# EAGLE design TPS62827 3.3V Buck Converter (EAGLE 9.6.2)
COMPANY: ADAFRUIT INDUSTRIES; DRAWN: KTOWN; REV: A
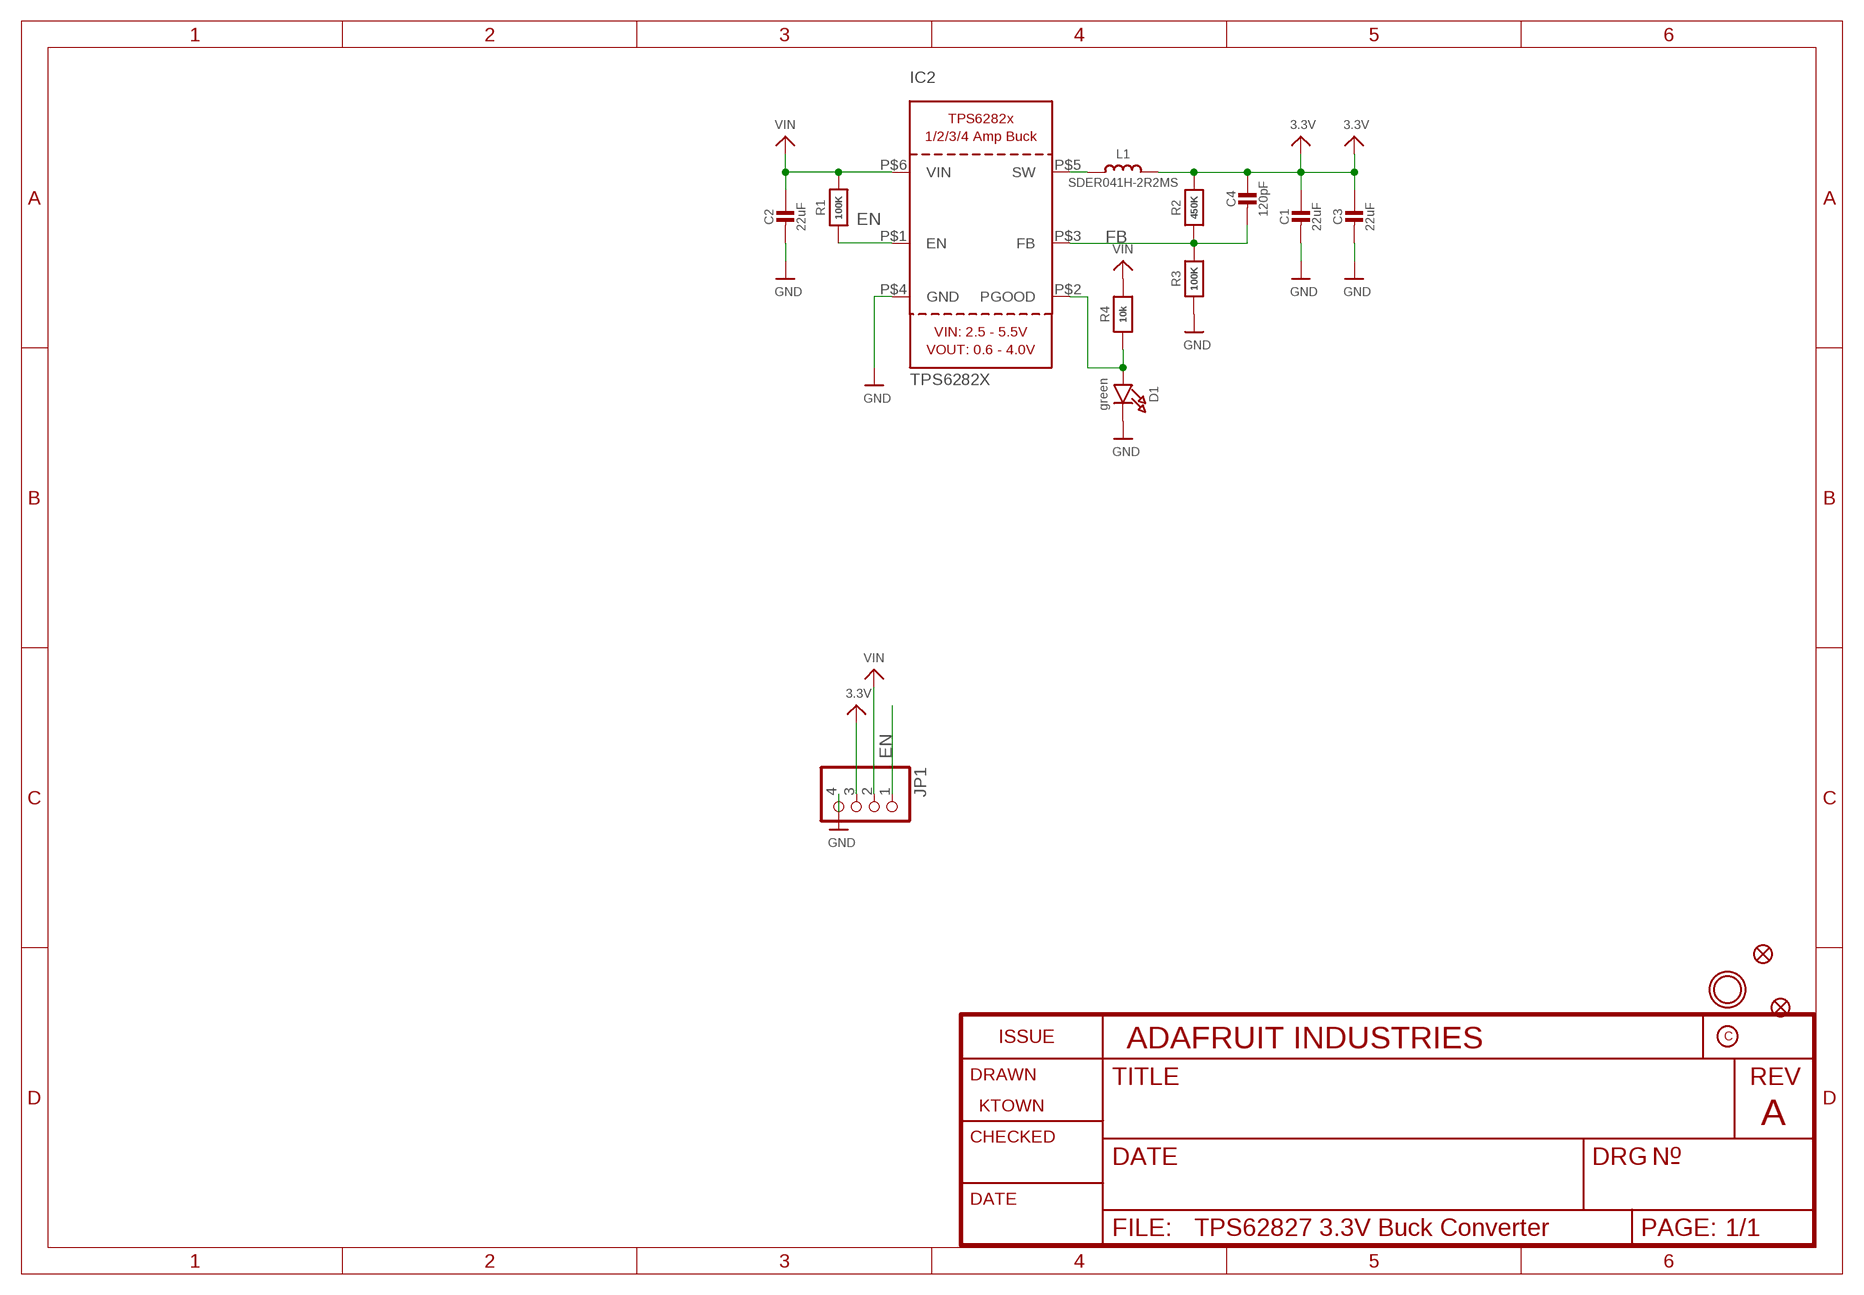
[diagram p0: schematic, sheet 1]

## Parts
C1  22uF  CAP_CERAMIC0805-NOOUTLINE  [0805-NO]
C2  22uF  CAP_CERAMIC0805-NOOUTLINE  [0805-NO]
C3  22uF  CAP_CERAMIC0805-NOOUTLINE  [0805-NO]
C4  120pF  CAP_CERAMIC0603_NO  [0603-NO]
D1  green  LED0603_NOOUTLINE  [CHIPLED_0603_NOOUTLINE]
FID1  FIDUCIAL_1MM  [FIDUCIAL_1MM]
FID2  FIDUCIAL_1MM  [FIDUCIAL_1MM]
IC2  TPS6282X  [VSON_6]
JP1  HEADER-1X4ROUND  [1X04_ROUND]
L1  SDER041H-2R2MS  INDUCTOR_SRP0415  [INDUCTOR_4X4MM_SRP0415]
R1  100K  RESISTOR_0603_NOOUT  [0603-NO]
R2  450K  RESISTOR_0603_NOOUT  [0603-NO]
R3  100K  RESISTOR_0603_NOOUT  [0603-NO]
R4  10k  RESISTOR_0603MP  [_0603MP]
U$9  MOUNTINGHOLE2.5  [MOUNTINGHOLE_2.5_PLATED]

## Nets
3.3V: C1.1 C3.1 C4.1 JP1.3 L1.P$2 R2.2
EN: IC2.P$1(EN) JP1.1 R1.2
FB: C4.2 IC2.P$3(FB) R2.1 R3.2
GND: C1.2 C2.2 C3.2 D1.C IC2.P$4(GND) JP1.4 R3.1
N$1: IC2.P$5(SW) L1.P$1
N$2: D1.A IC2.P$2(PGOOD) R4.1
VIN: C2.1 IC2.P$6(VIN) JP1.2 R1.1 R4.2

## Library data of the parts
C1-C4 = microbuilder:CAP_CERAMIC: Ceramic Capacitors For new designs, use the packages preceded by an '_' character since they are more reliable: The following footprints should be used on most boards: _0402 - Standard footprint for regular board layouts _0603 - Standard footprint for regular board layouts _0805 - Standard footprint for regular board layouts _1206 - Standard footprint for regular board layouts For extremely tight-pitch boards where space is at a premium, the following 'micro-pitch' footprints can be used (smaller pads, no silkscreen outline, etc.): _0402MP - Micro-pitch footprint for very dense/compact boards _0603MP - Micro-pitch footprint for very dense/compact boards _0805MP - Micro-pitch footprint for very dense/compact boards _1206MP - Micro-pitch footprint for very dense/compact boards
D1 = microbuilder:LED: LED 0603 - 0603 Surface Mount Package 2mA: Green LED - Low Power (3.9mcd, 2ma, 1.7Vf) - Digikey: 475-2709-2-ND Orange LED - Low Power (9.8mcd, 2ma, 1.8Vf) - Digikey: 475-1194-2-ND Red LED - Low Power (5mcd, 2ma, 1.8Vf) - Digikey: 475-1195-2-ND Yellow LED - Low Power (7mcd, 2ma, 1.8Vf) - Digikey: 475-1196-2-ND 5mA: Blue LED - Low Power (17mcd, 5ma, 2.9Vf) - Digikey: LNJ937W8CRACT-ND 0805 - 0805 Surface Mount Package 2mA: Red LED (8.8mcd, 2mA, 1.8Vf, Clear) - Low Power [Digikey: 475-2510-1-ND] Green LED (5mcd, 2mA, 1.8Vf, Clear) - Low Power [Digikey: 475-2730-1-ND] Yellow LED (11.3mcd, 2mA, 1.8Vf, Clear) - Low Power [Digikey: 475-2555-1-ND] 20mA: Red LED (104mcd, 20mA, Diffused) - LS R976 [Digikey: 475-1278-6-ND] Red LED (12mcd, 20mA, 2.0Vf, Clear) - APT2012EC [Digikey: 754-1128-1-ND] Green LED (15mcd, 20mA, 2.2Vf, Clear) - APT2012GC [Digikey: 754-1131-1-ND] Orange LED (160mcd, 20mA, 2.1Vf, Clear) - APT2012SECK [Digikey: 754-1130-1-ND] 1206 - 1206 Surface Mount Package Green LED (26mcd, 20mA, Diffused) - LG N971 [Digikey: 475-1407-6-ND] Red LED (15mcd, 20mA, Diffused) - LH N974 [Digikey: 475-1416-6-ND] Cree - Cree High-Power Surface Mount LEDs XPEBWT-L1-0000-00D50 - White 111lm 350mA 2.9Vf 6200K 110° XTEAWT-00-0000-00000LEE3 - White 114lm 350mA 2.85Vf 5000K 115° Everlight - Everlight 45-21 Series Surface Mount LEDs 45-21/QK2C-B2832AC2CB2/2T - Warm White 2000mcd 20mA 3.25Vf 3050K 120° 45-21/LK2C-B38452C4CB2/2T - Nuetral White 2000mcd 20mA 3.25Vf 4150K 120° 45-21/LK2C-B50634C6CB2/2T - Cold White 2200mcd 20mA 3.25Vf 5650K 120° PLCC2 Reverse Mount LS T77K-J1L2-1-0-2-R18-Z - Red 11.25mcd 2mA 1.8Vf 630nm 120° LO T77K-L1M2-24-Z - Orange 19.6mcd 2mA 1.8Vf 606nm 120° LY T77K-K2M1-26-Z - Yellow 15.7mcd 2mA 1.8Vf 587nm 120°
FID1 FID2 = microbuilder:FIDUCIAL: Fiducial Alignment Points Various fiducial points for machine vision alignment.; BOM: EXCLUDE
IC2 = adafruit_power:TPS6282X
JP1 = microbuilder:HEADER-1X4: PIN HEADER
L1 = microbuilder:INDUCTOR: Inductors 0603: 10nH Ceramic Inductor - microwire antenna/RF (Digikey: 712-1434-2-ND) 0805: 560nH Ceramic Inductor - RF (Digikey: 553-1047-1-ND) 270nH Ceramic Inductor - Q = 40@250MHz, +-5%, 1 Ohm DC Resistance (Digikey: 535-10506-2-ND) 1007 (2518 Metric) SMT: 10µH 10% 250mOhm 820mA 1007 Inductor (Digikey: 587-2189-1-ND) 22µH 10% 500mOhm 580mA 1007 Inductor (Digikey: 587-2190-1-ND) 47µH 10% 950mOhm 420mA 1007 Inductor (Digikey: 587-2191-1-ND) 47µH 5% 100mOhm 1A 1008 Inductor (Digikey: 732-1816-1-ND) 5.0x5.0mm (Taiyo Yuden NR5040 Series) 6.8µH 20% 2.3A 64mOhm Inductor (Digikey: 587-2374-2-ND) 5.0x5.0mm (TDK VLC5045 Series) 4.7µH 20% 3.3A 34mOhm Inductor (Digikey: 445-6526-1-ND) 6.8µH 20% 2.7A 46mOhm Inductor (Digikey: 445-6527-1-ND) 6.0x6.0mm (TDK VLC6045 Series) 4.7µH 20% 3.8A 27mOhm Inductor (Digikey: 445-6538-2-ND) 6.8µH 20% 3A 41mOhm Inductor (Digikey: 445-6540-1-ND) 6.2µH 30% 2.2A 45mOhm Inductor (Digikey: SRR5028-6R2YCT-ND) - Not TDK VLC6045 but footprint should match 6.0x6.0mm (TDK SLF6045 Series) 6.8uH 30% 2A 33mOhm Inductor (Digikey: 445-4572-1-ND, Mouser: 810-SLF645T6R8N2R0PF) 6.0x6.0mm (Sumida CDRH5D28 Series) 6.2uH 30% 1.8A 45mOhm Inductor (Digikey: 308-1542-1-ND) Taiyo Yuden NR3015T2R2M - 2.2uH 20% 1.5A (Digikey: 587-1648-2-ND, Mouser: 963-NR3015T2R2M) - Used with TI TPS62172 CoilCraft RFID Transponder Coil - MA5532-AE (For use with AS3935 Lightning Sensor) Taiyo Yuden NRH2412T2R2MNGH - 2.2uH 20% 1AA (Digikey: 587-3443-1-ND) - Used with TI LM3671 Vishay IHLP 1.0uH Molded Inductor - 24mOhm DCR, 5A, +/-20%, -55°C-125°C (Digikey: 541-1319-1-ND)
R1-R4 = microbuilder:RESISTOR: Resistors For new designs, use the packages preceded by an '_' character since they are more reliable: The following footprints should be used on most boards: _0402 - Standard footprint for regular board layouts _0603 - Standard footprint for regular board layouts _0805 - Standard footprint for regular board layouts _1206 - Standard footprint for regular board layouts For extremely tight-pitch boards where space is at a premium, the following 'micro-pitch' footprints can be used (smaller pads, no silkscreen outline, etc.): _0402MP - Micro-pitch footprint for very dense/compact boards _0603MP - Micro-pitch footprint for very dense/compact boards _0805MP - Micro-pitch footprint for very dense/compact boards _1206MP - Micro-pitch footprint for very dense/compact boards
U$9 = microbuilder:MOUNTINGHOLE: Mounting Hole For #2 screws (0.086"/2.18mm width, 0.094"/2.4mm hole) use 2.5mm; BOM: EXCLUDE

## Board
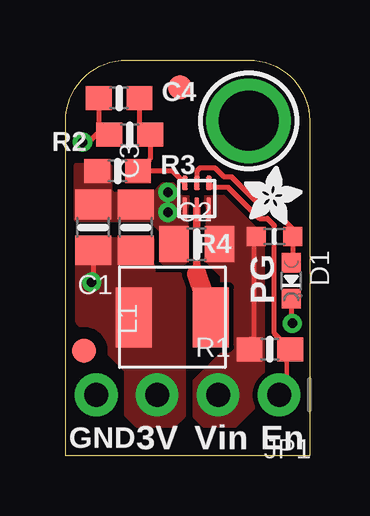
[diagram p1: board, top side]
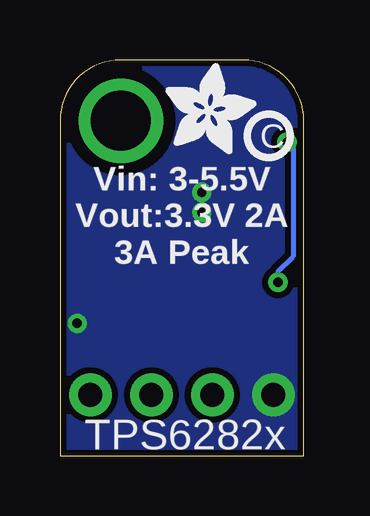
[diagram p2: board, bottom side, seen from below]

Size 10.16 x 16.51 mm. Coordinates in mm from the lower left corner, seen from the top.
Outline: 0,0 0,13.97 arc-90 2.54,16.51 7.62,16.51 arc-90 10.16,13.97 10.16,0 0,0
Copper layers (1*16): Top 0.035mm / dielectric 1.5mm / Bottom 0.035mm
Design rules "adafruit 7-7": minimum track width 6mil, minimum drill 15.5mil, track to track 8mil, track to pad 7mil, pad to pad 7mil, via to via 7mil, smd to smd 7mil, copper to edge 10mil, drill to drill 8mil, minimum pad ring 10mil, minimum via ring 8mil, stop-mask expansion 2mil, vias tented up to drill 20mil, thermal gap 10mil

### Footprints (pad centres in the part's own frame; a part is rotated, then mirrored left to right if it is on the bottom)
0805-NO = smd 1.24 x 1.5: 1 -0.95,0; 2 0.95,0
0603-NO = smd 1.075 x 1: 1 -0.85,0; 2 0.85,0
CHIPLED_0603_NOOUTLINE = smd 0.8 x 0.8: A 0,-0.75; C 0,0.75
FIDUCIAL_1MM = smd 1 x 1: 1 0,0
VSON_6 = smd 0.6 x 0.25: P$1 -0.65,0.5; P$2 -0.65,0; P$3 -0.65,-0.5 | smd 1 x 0.2: P$4 0.45,-0.5; P$5 0.45,0; P$6 0.45,0.5
1X04_ROUND = drill 1 pad 1.778: 1 -3.81,0; 2 -1.27,0; 3 1.27,0; 4 3.81,0
INDUCTOR_4X4MM_SRP0415 = smd 1.5 x 2.5: P$1 -1.6,0; P$2 1.6,0
_0603MP = smd 0.8 x 0.8: 1 -0.762,0; 2 0.762,0
MOUNTINGHOLE_2.5_PLATED = drill 2.5 pad 3.2: P$1 0,0

### Placement (x,y rotation side)
C1  1.14,9.53 90 top
C2  5.46,8.83 180 top
C3  2.92,9.53 90 top
C4  2.22,14.92 0 top
D1  9.4,7.3 180 top
FID1  0.76,4.38 0 top
FID2  4.76,15.37 0 top
IC2  5.46,10.73 270 top
JP1  5.08,2.54 180 top
L1  4.45,5.78 180 top
R1  8.51,4.45 0 top
R2  2.67,13.4 180 top
R3  2.16,11.87 0 top
R4  8.7,9.14 180 top
U$9  7.62,13.97 0 top
U$10  [PCBFEAT-REV-040]  1.46,13.34 0 bottom
U$11  [ADAFRUIT_2.5MM]  7.43,9.65 0 top
U$18  [ADAFRUIT_3.5MM]  5.78,12.57 0 bottom

### Tracks (layer width: path | path; a pad name or v marks a point on that pad's centre or on a via)
3.3V  (via drill 0.39)
  Top 0.203: C4.1 1.37,13.84 R2.2 1.27,13.4 0.95,13.08 v0.7,13.08 | C1.1 1.14,7.24 v1.08,7.24
  Bottom 0.203: v0.7,13.08 0.45,12.83 0.45,8.32 1.08,7.68 v1.08,7.24
  pour Top (no thermals): 0.51,9.02 3.62,9.02 3.62,7.56 4.76,7.56 4.89,7.43 4.89,1.65 4.51,1.27 2.98,1.27 2.54,1.71 2.54,3.56 0.51,5.59
EN
  Top 0.178: 9.2,3.94 9.2,2.85 JP1.1
  Top 0.203: IC2.P$1 6.15,11.19 6.78,11.19 8.07,9.9 8.4,9.9 8.7,9.6 8.7,5.1 R1.2 9.2,4.29 9.2,3.94
FB
  Top 0.203: IC2.P$3 4.47,11.87 R3.2 3.52,12.38 R2.1 3.07,13.84 C4.2
GND  (via drill 0.39)
  Top 0.203: D1.C 9.4,5.57 v9.44,5.52
  other vias: 4.25,10.16 4.25,10.99
  pour Bottom (isolate 0.254, no thermals): 0,0 0,16.51 10.16,16.51 10.16,0
  pour Top (no thermals): 0.44,12.13 1.78,12.13 1.84,12.06 1.84,11.05 1.97,10.92 3.68,10.92 4.06,11.3 4.83,11.3 5.21,10.92 5.21,8.13 5.14,8.06 4.06,8.06 4.06,9.33 3.56,9.84 0.44,9.84
N$1
  Top 0.203: IC2.P$5
  Top 0.305: IC2.P$5 5.46,7.58
  Top 0.813: L1.P$1 6.04,5.87 5.46,7.58
N$2
  Top 0.203: IC2.P$2 5.46,11.87 5.59,12 6.22,12 6.59,11.64 6.91,11.64 8.19,10.35 8.57,10.35 9.46,9.46 R4.1 9.46,8.12 D1.A
VIN
  Top 0.203: 7.84,9.34 7.84,4.93 7.67,4.86 7.67,4.64
  pour Top (no thermals): 5.4,1.65 5.4,3.11 6.54,4.25 6.54,7.49 5.91,8.13 5.91,9.59 5.65,9.84 5.65,10.79 5.71,10.86 6.48,10.86 8.19,9.14 8.19,2.41 7.05,1.27 5.78,1.27

### Text on the board
tPlace: PG | GND | 3V | Vin | En
bPlace: Vin: 3-5.5V / Vout:3.3V 2A / 3A Peak | TPS6282x